# EAGLE schematic dimmer.v2 (EAGLE 7.3.0)
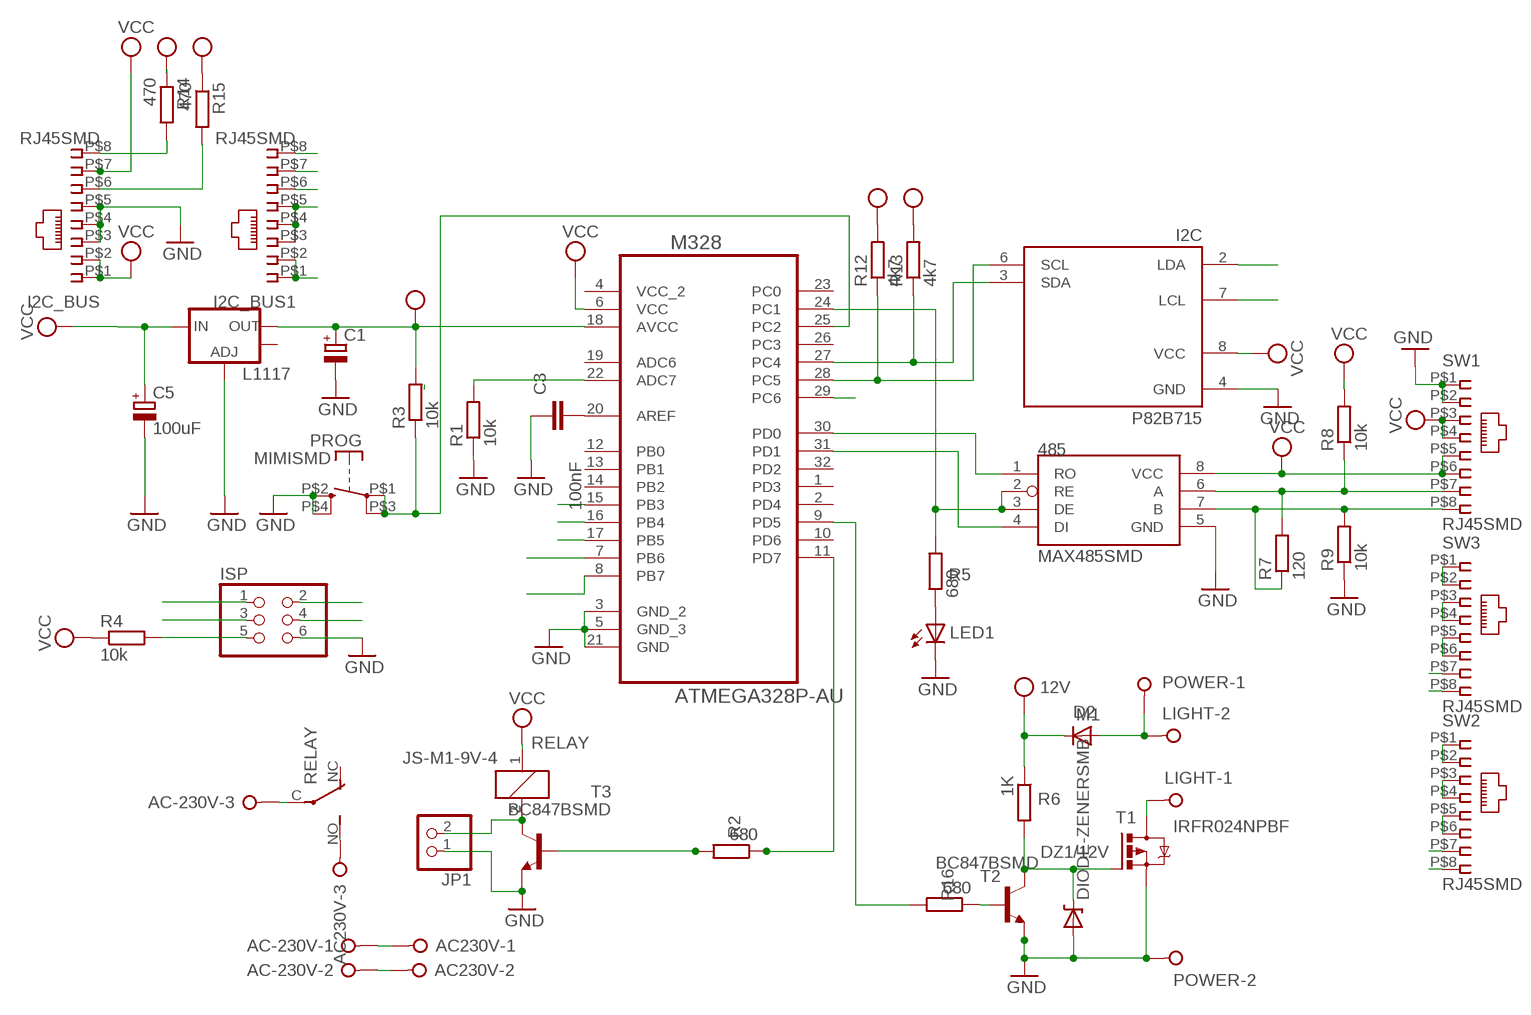
[diagram p0: schematic, sheet 1]

## Parts
485  MAX485SMD  [SO08]
AC230V  W237-3E  [W237-3E]
AC-230V  W237-3E  [W237-3E]
C1  CPOL-EUC/6032-28W  [C/6032-28W]
C3  100nF  C-EUC1206  [C1206]
C5  100uF  CPOL-EU140CLH-0810  [140CLH-0810]
D2  M1  ES2D  [SMB]
DZ1/12V  DIODE-ZENERSMB  [SMB-DIODE]
I2C  P82B715  [P82B715SMD]
I2C_BUS  RJ45SMD  [RJ45SMD]
I2C_BUS1  RJ45SMD  [RJ45SMD]
ISP  PINHD-2X3  [2X03]
JP1  PINHD-1X2  [1X02]
L1117  V_REG_LM1117SOT223  [SOT223]
LED1  LEDSML1206  [SML1206]
LIGHT  W237-02P  [W237-132]
M328  ATMEGA328P-AU  [QFP80P900X900X120-32N]
POWER  W237-02P  [W237-132]
PROG  MIMISMD  [MINISMD]
R1  10k  R-EU_R1206  [R1206]
R2  680  R-EU_R1206  [R1206]
R3  10k  R-EU_R1206  [R1206]
R4  10k  R-EU_R1206  [R1206]
R5  680  R-EU_R1206  [R1206]
R6  1K  R-EU_R1206  [R1206]
R7  120  R-EU_R1206  [R1206]
R8  10k  R-EU_R1206  [R1206]
R9  10k  R-EU_R1206  [R1206]
R12  4k7  R-EU_R1206  [R1206]
R13  4k7  R-EU_R1206  [R1206]
R14  470  R-EU_R1206  [R1206]
R15  470  R-EU_R1206  [R1206]
R16  680  R-EU_R1206  [R1206]
RELAY  JS-M1-9V-4  [JS-M]
SW1  RJ45SMD  [RJ45SMD]
SW2  RJ45SMD  [RJ45SMD]
SW3  RJ45SMD  [RJ45SMD]
T1  IRFR024NPBF  IRFR5305  [D-PAK_TO252AA]
T2  BC847BSMD  [SOT23]
T3  BC847BSMD  [SOT23]

## Nets
12V: D2.A LIGHT.2 POWER.1
+12V: C5.+ D2.C I2C_BUS1.P$1 I2C_BUS1.P$2 I2C_BUS.P$1 I2C_BUS.P$2 L1117.3(IN) R6.1 SW1.P$3 SW1.P$4 SW2.P$3 SW2.P$4 SW3.P$3 SW3.P$4 ; supply symbol labelled VCC, 12V
A: 485.6(A) R7.2 R8.1 SW1.P$7 SW2.P$7 SW3.P$7
B: 485.7(B) R7.1 R9.2 SW1.P$8 SW2.P$8 SW3.P$8
GND: 485.5(GND) C1.- C3.2 C5.- DZ1/12V.A I2C.4(GND) I2C_BUS1.P$3 I2C_BUS1.P$4 I2C_BUS1.P$5 I2C_BUS.P$3 I2C_BUS.P$4 I2C_BUS.P$5 ISP.6 JP1.1 L1117.1(ADJ) LED1.C M328.3(GND_2) M328.5(GND_3) M328.21(GND) POWER.2 PROG.P$2(S) PROG.P$4(S) R1.1 R9.1 SW1.P$1 SW1.P$2 SW2.P$1 SW2.P$2 SW3.P$1 SW3.P$2 T1.3(S) T2.2(E) T3.2(E)
LX: I2C.2(LDA) I2C_BUS1.P$8 I2C_BUS.P$8 R14.2
LY: I2C.7(LCL) I2C_BUS1.P$6 I2C_BUS.P$6 R15.2
MISO: ISP.1 M328.16(PB4)
MOSI: ISP.4 M328.15(PB3)
N$2: R16.1 T2.1(B)
N$4: 485.4(DI) M328.31(PD1)
N$5: 485.1(RO) M328.30(PD0)
N$6: M328.25(PC2) PROG.P$1(P) PROG.P$3(P) R3.1
N$7: M328.9(PD5) R16.2
N$8: AC230V.3 RELAY.NO(2:S)
N$9: AC230V.1 AC-230V.1
N$10: AC230V.2 AC-230V.2
N$12: DZ1/12V.C R6.2 T1.1(G) T2.3(C)
N$13: R2.2 T3.1(B)
N$15: LIGHT.1 T1.4(D)
N$16: AC-230V.3 RELAY.C(2:P)
N$18: 485.2(RE) 485.3(DE) M328.24(PC1) R5.2
N$26: M328.22(ADC7) R1.2
N$33: M328.11(PD7) R2.1
N$36: C3.1 M328.20(AREF)
N$41: JP1.2 RELAY.2 T3.3(C)
N$48: LED1.A R5.1
N$49: M328.7(PB6)
N$50: M328.8(PB7)
RESET: ISP.5 M328.29(PC6) R4.2
SCK: ISP.3 M328.17(PB5)
SCL: I2C.6(SCL) M328.28(PC5) R12.1
SDA: I2C.3(SDA) M328.27(PC4) R13.1
VCC: 485.8(VCC) C1.+ I2C.8(VCC) I2C_BUS1.P$7 I2C_BUS.P$7 ISP.2 L1117.2(OUT) M328.6(VCC) M328.18(AVCC) R3.2 R4.1 R8.2 R12.2 R13.2 R14.1 R15.1 RELAY.1 SW1.P$5 SW1.P$6 SW2.P$5 SW2.P$6 SW3.P$5 SW3.P$6
Unconnected: L1117.4(OUT) M328.1(PD3) M328.2(PD4) M328.10(PD6) M328.12(PB0) M328.13(PB1) M328.14(PB2) M328.19(ADC6) M328.23(PC0) M328.26(PC3) M328.32(PD2) RELAY.NC(2:O)

## Power pins joined to a net without a drawn wire
VCC_2: M328.4(VCC_2)

## Library data of the parts
485 = maxim:MAX485SMD
AC230V AC-230V = con-wago-508:W237-3E: WAGO SREW CLAMP; OC_FARNELL: unknown; OC_NEWARK: unknown
C1 C5 = rcl:CPOL-EU: POLARIZED CAPACITOR, European symbol
C3 = rcl:C-EU: CAPACITOR, European symbol
D2 = diode:ES2D: DIODE super fast rectifier, 2 A
DZ1/12V = sparkfun:DIODE-ZENER: Zener Diode Production Part - 8199 3.4V Zener Voltage
I2C = i2c:P82B715
I2C_BUS I2C_BUS1 SW1-SW3 = con-tycoelectronics:RJ45SMD
ISP = pinhead:PINHD-2X3: PIN HEADER
JP1 = pinhead:PINHD-1X2: PIN HEADER
L1117 = sparkfun:V_REG_LM1117: Voltage Regulator LM1117 Standard adjustable voltage regulator but in SMD form. Spark Fun Electronics SKU : COM-00595
LED1 = led:LED: LED OSRAM: - CHIPLED LG R971, LG N971, LY N971, LG Q971, LY Q971, LO R971, LY R971 LH N974, LH R974 LS Q976, LO Q976, LY Q976 LO Q996 - Hyper CHIPLED LW Q18S LB Q993, LB Q99A, LB R99A - SideLED LS A670, LO A670, LY A670, LG A670, LP A670 LB A673, LV A673, LT A673, LW A673 LH A674 LY A675 LS A676, LA A676, LO A676, LY A676, LW A676 LS A679, LY A679, LG A679 - Hyper Micro SIDELED® LS Y876, LA Y876, LO Y876, LY Y876 LT Y87S - SmartLED LW L88C, LW L88S LB L89C, LB L89S, LG L890 LS L89K, LO L89K, LY L89K LS L896, LA L896, LO L896, LY L896 - TOPLED LS T670, LO T670, LY T670, LG T670, LP T670 LSG T670, LSP T670, LSY T670, LOP T670, LYG T670 LG T671, LOG T671, LSG T671 LB T673, LV T673, LT T673, LW T673 LH T674 LS T676, LA T676, LO T676, LY T676, LB T676, LH T676, LSB T676, LW T676 LB T67C, LV T67C, LT T67C, LS T67K, LO T67K, LY T67K, LW E67C LS E67B, LA E67B, LO E67B, LY E67B, LB E67C, LV E67C, LT E67C LW T67C LS T679, LY T679, LG T679 LS T770, LO T770, LY T770, LG T770, LP T770 LB T773, LV T773, LT T773, LW T773 LH T774 LS E675, LA E675, LY E675, LS T675 LS T776, LA T776, LO T776, LY T776, LB T776 LHGB T686 LT T68C, LB T68C - Hyper Mini TOPLED® LB M676 - Mini TOPLED Santana® LG M470 LS M47K, LO M47K, LY M47K Source: http://www.osram.convergy.de LUXEON: - LUMILED® LXK2-PW12-R00, LXK2-PW12-S00, LXK2-PW14-U00, LXK2-PW14-V00 LXK2-PM12-R00, LXK2-PM12-S00, LXK2-PM14-U00 LXK2-PE12-Q00, LXK2-PE12-R00, LXK2-PE12-S00, LXK2-PE14-T00, LXK2-PE14-U00 LXK2-PB12-K00, LXK2-PB12-L00, LXK2-PB12-M00, LXK2-PB14-N00, LXK2-PB14-P00, LXK2-PB14-Q00 LXK2-PR12-L00, LXK2-PR12-M00, LXK2-PR14-Q00, LXK2-PR14-R00 LXK2-PD12-Q00, LXK2-PD12-R00, LXK2-PD12-S00 LXK2-PH12-R00, LXK2-PH12-S00 LXK2-PL12-P00, LXK2-PL12-Q00, LXK2-PL12-R00 Source: www.luxeon.com KINGBRIGHT: KA-3528ASYC Source: www.kingbright.com
LIGHT POWER = con-wago-508:W237-02P: WAGO SREW CLAMP; OC_FARNELL: unknown; OC_NEWARK: unknown
M328 = atmega328:ATMEGA328P-AU: 8-bit Microcontroller with In-System Programmable Flash; MPN: ATMEGA328P-AU; OC_FARNELL: 1715486; OC_NEWARK: 14R4631; PACKAGE: TQFP-32; SUPPLIER: Atmel
PROG = switch-misc:MIMISMD
R1-R9 R12-R16 = rcl:R-EU_: RESISTOR, European symbol
RELAY = relay:JS-M1*: Automotive Ultra-Miniature Power Relay NAiS Source: http://www.mew-europe.com/.. en_ds_61211_0000.pdf; OC_FARNELL: unknown; OC_NEWARK: unknown
T1 = transistor-power:IRF?5305: HEXFET Power MOSFET Source: http://www.irf.com/product-info/datasheets/data/irfr5305pbf.pdf
T2 T3 = transistor-npn:BC847*: NPN Transistor